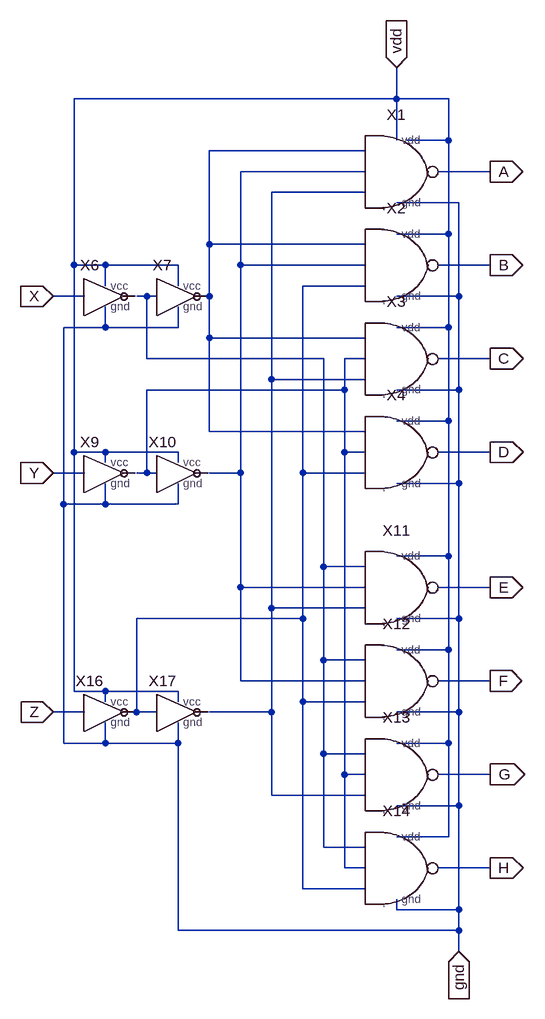
[diagram p0: schematic 8-1seldec.asc]
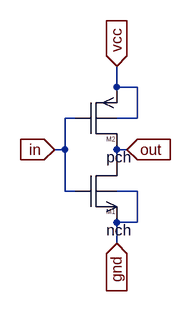
[diagram p1: sub-circuit myinv.asc]
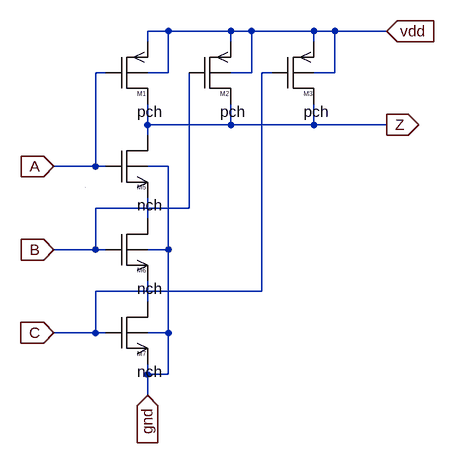
[diagram p2: sub-circuit mynand3.asc]
8-1seldec.asc, the LTspice schematic file:
Version 4
SHEET 1 1588 1020
WIRE -80 -416 -80 -464
WIRE -80 -416 -576 -416
WIRE 0 -416 -80 -416
WIRE -80 -352 -80 -416
WIRE 0 -352 0 -416
WIRE 0 -352 -64 -352
WIRE -128 -336 -368 -336
WIRE -128 -304 -320 -304
WIRE 64 -304 -16 -304
WIRE -128 -272 -272 -272
WIRE 16 -256 -80 -256
WIRE 0 -208 0 -352
WIRE 0 -208 -80 -208
WIRE -368 -192 -368 -336
WIRE -128 -192 -368 -192
WIRE -576 -160 -576 -416
WIRE -528 -160 -576 -160
WIRE -416 -160 -528 -160
WIRE -320 -160 -320 -304
WIRE -128 -160 -320 -160
WIRE 64 -160 -16 -160
WIRE -528 -128 -528 -160
WIRE -416 -128 -416 -160
WIRE -128 -128 -224 -128
WIRE -560 -112 -608 -112
WIRE -464 -112 -480 -112
WIRE -448 -112 -464 -112
WIRE -368 -112 -368 -192
WIRE 16 -112 16 -256
WIRE 16 -112 -80 -112
WIRE -528 -64 -528 -96
WIRE -528 -64 -592 -64
WIRE -416 -64 -416 -96
WIRE -416 -64 -528 -64
WIRE 0 -64 0 -208
WIRE 0 -64 -80 -64
WIRE -368 -48 -368 -112
WIRE -128 -48 -368 -48
WIRE -464 -16 -464 -112
WIRE -192 -16 -464 -16
WIRE -128 -16 -160 -16
WIRE 64 -16 -16 -16
WIRE -272 16 -272 -272
WIRE -128 16 -272 16
WIRE -160 32 -160 -16
WIRE -160 32 -464 32
WIRE 16 32 16 -112
WIRE 16 32 -80 32
WIRE 0 80 0 -64
WIRE 0 80 -80 80
WIRE -368 96 -368 -48
WIRE -128 96 -368 96
WIRE -576 128 -576 -160
WIRE -528 128 -576 128
WIRE -416 128 -528 128
WIRE -160 128 -160 32
WIRE -128 128 -160 128
WIRE 64 128 -16 128
WIRE -528 144 -528 128
WIRE -416 144 -416 128
WIRE -560 160 -608 160
WIRE -464 160 -464 32
WIRE -464 160 -480 160
WIRE -448 160 -464 160
WIRE -320 160 -320 -160
WIRE -320 160 -368 160
WIRE -224 160 -224 -128
WIRE -128 160 -224 160
WIRE 16 176 16 32
WIRE 16 176 -80 176
WIRE -592 208 -592 -64
WIRE -528 208 -528 176
WIRE -528 208 -592 208
WIRE -416 208 -416 176
WIRE -416 208 -528 208
WIRE 0 288 0 80
WIRE 0 288 -80 288
WIRE -192 304 -192 -16
WIRE -128 304 -192 304
WIRE -320 336 -320 160
WIRE -128 336 -320 336
WIRE 64 336 -16 336
WIRE -272 368 -272 16
WIRE -128 368 -272 368
WIRE -224 384 -224 160
WIRE -224 384 -480 384
WIRE 16 384 16 176
WIRE 16 384 -80 384
WIRE 0 432 0 288
WIRE 0 432 -80 432
WIRE -192 448 -192 304
WIRE -128 448 -192 448
WIRE -320 480 -320 336
WIRE -128 480 -320 480
WIRE 64 480 -16 480
WIRE -576 496 -576 128
WIRE -528 496 -576 496
WIRE -416 496 -528 496
WIRE -528 512 -528 496
WIRE -416 512 -416 496
WIRE -224 512 -224 384
WIRE -128 512 -224 512
WIRE -560 528 -608 528
WIRE -480 528 -480 384
WIRE -448 528 -480 528
WIRE -272 528 -272 368
WIRE -272 528 -368 528
WIRE 16 528 16 384
WIRE 16 528 -80 528
WIRE -592 576 -592 208
WIRE -528 576 -528 544
WIRE -528 576 -592 576
WIRE -416 576 -416 544
WIRE -416 576 -528 576
WIRE 0 576 0 432
WIRE 0 576 -80 576
WIRE -192 592 -192 448
WIRE -128 592 -192 592
WIRE -160 624 -160 128
WIRE -128 624 -160 624
WIRE 64 624 -16 624
WIRE -272 656 -272 528
WIRE -128 656 -272 656
WIRE 16 672 16 528
WIRE 16 672 -80 672
WIRE 0 720 0 576
WIRE 0 720 -80 720
WIRE -192 736 -192 592
WIRE -128 736 -192 736
WIRE -160 768 -160 624
WIRE -128 768 -160 768
WIRE 64 768 -16 768
WIRE -224 800 -224 512
WIRE -128 800 -224 800
WIRE -80 832 -80 816
WIRE 16 832 16 672
WIRE 16 832 -80 832
WIRE -416 864 -416 576
WIRE 16 864 16 832
WIRE 16 864 -416 864
WIRE 16 896 16 864
FLAG 16 896 gnd
IOPIN 16 896 In
FLAG -80 -464 vdd
IOPIN -80 -464 In
FLAG -608 -112 X
IOPIN -608 -112 In
FLAG -608 160 Y
IOPIN -608 160 In
FLAG -608 528 Z
IOPIN -608 528 In
FLAG 64 -304 A
IOPIN 64 -304 Out
FLAG 64 -160 B
IOPIN 64 -160 Out
FLAG 64 -16 C
IOPIN 64 -16 Out
FLAG 64 128 D
IOPIN 64 128 Out
FLAG 64 336 E
IOPIN 64 336 Out
FLAG 64 480 F
IOPIN 64 480 Out
FLAG 64 624 G
IOPIN 64 624 Out
FLAG 64 768 H
IOPIN 64 768 Out
SYMBOL myinv -528 -96 R0
SYMATTR InstName X6
SYMBOL myinv -416 -96 R0
SYMATTR InstName X7
SYMBOL myinv -528 176 R0
SYMATTR InstName X9
SYMBOL myinv -416 176 R0
SYMATTR InstName X10
SYMBOL myinv -528 544 R0
SYMATTR InstName X16
SYMBOL myinv -416 544 R0
SYMATTR InstName X17
SYMBOL mynand3 -80 -272 R0
SYMATTR InstName X1
SYMBOL mynand3 -80 -128 R0
SYMATTR InstName X2
SYMBOL mynand3 -80 16 R0
SYMATTR InstName X3
SYMBOL mynand3 -80 160 R0
SYMATTR InstName X4
SYMBOL mynand3 -80 368 R0
SYMATTR InstName X11
SYMBOL mynand3 -80 512 R0
SYMATTR InstName X12
SYMBOL mynand3 -80 656 R0
SYMATTR InstName X13
SYMBOL mynand3 -80 800 R0
SYMATTR InstName X14

myinv.asc, the sub-circuit schematic file:
Version 4
SHEET 1 880 680
WIRE 176 32 176 0
WIRE 208 32 176 32
WIRE 112 80 96 80
WIRE 208 80 208 32
WIRE 208 80 176 80
WIRE 96 128 96 80
WIRE 96 128 80 128
WIRE 192 128 176 128
WIRE 176 144 176 128
WIRE 96 192 96 128
WIRE 112 192 96 192
WIRE 208 192 176 192
WIRE 208 240 208 192
WIRE 208 240 176 240
WIRE 176 272 176 240
FLAG 176 272 gnd
IOPIN 176 272 In
FLAG 176 0 vcc
IOPIN 176 0 In
FLAG 80 128 in
IOPIN 80 128 In
FLAG 192 128 out
IOPIN 192 128 In
SYMBOL nmos4 112 192 R0
WINDOW 3 48 60 Left 2
SYMATTR InstName M1
SYMATTR Value nch
SYMATTR Value2 l=2u w=6u
SYMBOL pmos4 112 80 R0
WINDOW 3 48 60 Left 2
SYMATTR InstName M2
SYMATTR Value pch
SYMATTR Value2 l=2u w=18u

mynand3.asc, the sub-circuit schematic file:
Version 4
SHEET 1 880 680
WIRE 128 -240 96 -240
WIRE 224 -240 128 -240
WIRE 256 -240 224 -240
WIRE 352 -240 256 -240
WIRE 384 -240 352 -240
WIRE 464 -240 384 -240
WIRE 96 -224 96 -240
WIRE 224 -224 224 -240
WIRE 352 -224 352 -240
WIRE 32 -176 16 -176
WIRE 128 -176 128 -240
WIRE 128 -176 96 -176
WIRE 256 -176 256 -240
WIRE 256 -176 224 -176
WIRE 288 -176 272 -176
WIRE 384 -176 384 -240
WIRE 384 -176 352 -176
WIRE 96 -96 96 -128
WIRE 224 -96 224 -128
WIRE 224 -96 96 -96
WIRE 352 -96 352 -128
WIRE 352 -96 224 -96
WIRE 464 -96 352 -96
WIRE 96 -80 96 -96
WIRE 16 -32 16 -176
WIRE 16 -32 -48 -32
WIRE 32 -32 16 -32
WIRE 128 -32 96 -32
WIRE 160 32 160 -176
WIRE 160 32 16 32
WIRE 96 48 96 16
WIRE 16 96 16 32
WIRE 16 96 -48 96
WIRE 32 96 16 96
WIRE 128 96 128 -32
WIRE 128 96 96 96
WIRE 272 160 272 -176
WIRE 272 160 16 160
WIRE 96 176 96 144
WIRE 16 224 16 160
WIRE 16 224 -48 224
WIRE 32 224 16 224
WIRE 128 224 128 96
WIRE 128 224 96 224
WIRE 96 288 96 272
WIRE 128 288 128 224
WIRE 128 288 96 288
WIRE 96 320 96 288
WIRE 0 0 0 0
FLAG -48 -32 A
IOPIN -48 -32 In
FLAG -48 96 B
IOPIN -48 96 In
FLAG -48 224 C
IOPIN -48 224 In
FLAG 464 -96 Z
IOPIN 464 -96 Out
FLAG 96 320 gnd
IOPIN 96 320 In
FLAG 464 -240 vdd
IOPIN 464 -240 In
SYMBOL pmos4 32 -176 R0
WINDOW 3 48 60 Left 2
SYMATTR InstName M1
SYMATTR Value pch
SYMATTR Value2 l=2u w=18u
SYMBOL pmos4 160 -176 R0
WINDOW 3 48 60 Left 2
SYMATTR InstName M2
SYMATTR Value pch
SYMATTR Value2 l=2u w=18u
SYMBOL pmos4 288 -176 R0
WINDOW 3 48 60 Left 2
SYMATTR InstName M3
SYMATTR Value pch
SYMATTR Value2 l=2u w=18u
SYMBOL nmos4 32 -32 R0
WINDOW 3 48 60 Left 2
SYMATTR InstName M5
SYMATTR Value nch
SYMATTR Value2 l=2u w=6u
SYMBOL nmos4 32 96 R0
WINDOW 3 48 60 Left 2
SYMATTR InstName M6
SYMATTR Value nch
SYMATTR Value2 l=2u w=6u
SYMBOL nmos4 32 224 R0
WINDOW 3 48 60 Left 2
SYMATTR InstName M7
SYMATTR Value nch
SYMATTR Value2 l=2u w=6u

The netlist it stands for:
* 8-1seldec.asc
XX6 gnd X N005 vdd myinv
XX7 gnd N005 N001 vdd myinv
XX9 gnd Y N006 vdd myinv
XX10 gnd N006 N002 vdd myinv
XX16 gnd Z N004 vdd myinv
XX17 gnd N004 N003 vdd myinv
XX1 N001 N002 N003 gnd vdd A mynand3
XX2 N001 N002 N004 gnd vdd B mynand3
XX3 N001 N006 N003 gnd vdd C mynand3
XX4 N001 N006 N004 gnd vdd D mynand3
XX11 N005 N002 N003 gnd vdd E mynand3
XX12 N005 N002 N004 gnd vdd F mynand3
XX13 N005 N006 N003 gnd vdd G mynand3
XX14 N005 N006 N004 gnd vdd H mynand3

* block symbol definitions
.subckt myinv gnd in out vcc
M1 out in gnd gnd nch l=2u w=6u
M2 out in vcc vcc pch l=2u w=18u
.ends myinv

.subckt mynand3 A B C gnd vdd Z
M1 Z A vdd vdd pch l=2u w=18u
M2 Z B vdd vdd pch l=2u w=18u
M3 Z C vdd vdd pch l=2u w=18u
M5 Z A N001 gnd nch l=2u w=6u
M6 N001 B N002 gnd nch l=2u w=6u
M7 N002 C gnd gnd nch l=2u w=6u
.ends mynand3

.model NMOS NMOS
.model PMOS PMOS
.lib standard.mos
.backanno
.end